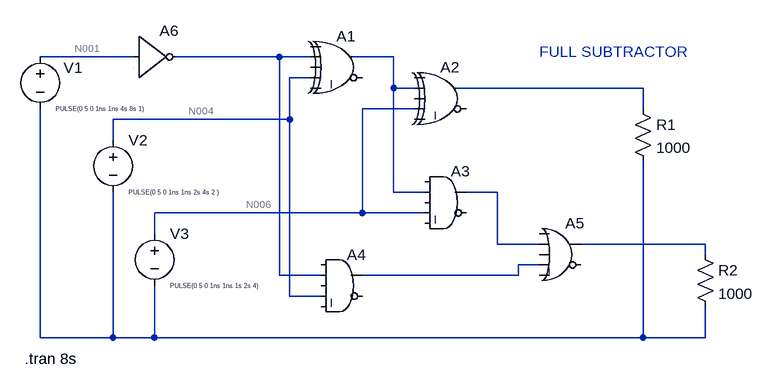
[diagram p0: schematic FULL_SUBTRACTOR_GOKUL.asc]
FULL_SUBTRACTOR_GOKUL.asc, the LTspice schematic file:
Version 4
SHEET 1 880 680
WIRE -272 -48 -416 -48
WIRE -48 -48 -208 -48
WIRE 0 -48 -48 -48
WIRE 128 -48 64 -48
WIRE 0 -16 -32 -16
WIRE 128 0 128 -48
WIRE 160 0 128 0
WIRE 512 0 224 0
WIRE 160 32 80 32
WIRE 512 32 512 0
WIRE -32 48 -32 -16
WIRE -32 48 -304 48
WIRE -304 80 -304 48
WIRE 128 160 128 0
WIRE 176 160 128 160
WIRE 288 160 240 160
WIRE 80 192 80 32
WIRE 80 192 -240 192
WIRE 176 192 80 192
WIRE -240 224 -240 192
WIRE 288 240 288 160
WIRE 352 240 288 240
WIRE 608 240 416 240
WIRE 608 256 608 240
WIRE 352 272 320 272
WIRE -48 288 -48 -48
WIRE 16 288 -48 288
WIRE 320 288 320 272
WIRE 320 288 80 288
WIRE -32 320 -32 48
WIRE 16 320 -32 320
WIRE -416 384 -416 32
WIRE -304 384 -304 160
WIRE -304 384 -416 384
WIRE -240 384 -240 304
WIRE -240 384 -304 384
WIRE 512 384 512 112
WIRE 512 384 -240 384
WIRE 608 384 608 336
WIRE 608 384 512 384
SYMBOL Digital\\xor 48 -96 R0
SYMATTR InstName A1
SYMBOL Digital\\xor 208 -48 R0
SYMATTR InstName A2
SYMBOL Digital\\and 208 112 R0
SYMATTR InstName A3
SYMBOL Digital\\and 48 240 R0
SYMATTR InstName A4
SYMBOL Digital\\or 384 192 R0
SYMATTR InstName A5
SYMBOL voltage -416 -64 R0
WINDOW 3 24 96 Left 0
WINDOW 123 0 0 Left 0
WINDOW 39 0 0 Left 0
WINDOW 0 36 33 Left 2
SYMATTR Value PULSE(0 5 0 1ns 1ns 4s 8s 1)
SYMATTR InstName V1
SYMBOL voltage -304 64 R0
WINDOW 3 24 96 Left 0
WINDOW 123 0 0 Left 0
WINDOW 39 0 0 Left 0
SYMATTR Value PULSE(0 5 0 1ns 1ns 2s 4s 2 )
SYMATTR InstName V2
SYMBOL voltage -240 208 R0
WINDOW 3 24 96 Left 0
WINDOW 123 0 0 Left 0
WINDOW 39 0 0 Left 0
SYMATTR Value PULSE(0 5 0 1ns 1ns 1s 2s 4)
SYMATTR InstName V3
SYMBOL res 496 16 R0
SYMATTR InstName R1
SYMATTR Value 1000
SYMBOL res 592 240 R0
SYMATTR InstName R2
SYMATTR Value 1000
SYMBOL Digital\\inv -272 -112 R0
SYMATTR InstName A6
TEXT -440 416 Left 2 !.tran 8s
TEXT 352 -56 Left 2 ;FULL SUBTRACTOR

The netlist it stands for:
* FULL_SUBTRACTOR_GOKUL.asc
A1 0 N002 0 N004 0 0 N003 0 XOR
A2 0 N003 0 N006 0 0 N005 0 XOR
A3 0 N003 0 N006 0 0 N007 0 AND
A4 0 N002 0 N004 0 0 N009 0 AND
A5 0 N007 0 N009 0 0 N008 0 OR
V1 N001 N010 PULSE(0 5 0 1ns 1ns 4s 8s 1)
V2 N004 N010 PULSE(0 5 0 1ns 1ns 2s 4s 2 )
V3 N006 N010 PULSE(0 5 0 1ns 1ns 1s 2s 4)
R1 N005 N010 1000
R2 N008 N010 1000
A6 N001 0 0 0 0 N002 0 0 BUF
.tran 8s
* FULL SUBTRACTOR
.backanno
.end

* Results of the author's LTspice run, read from the files saved beside the schematic
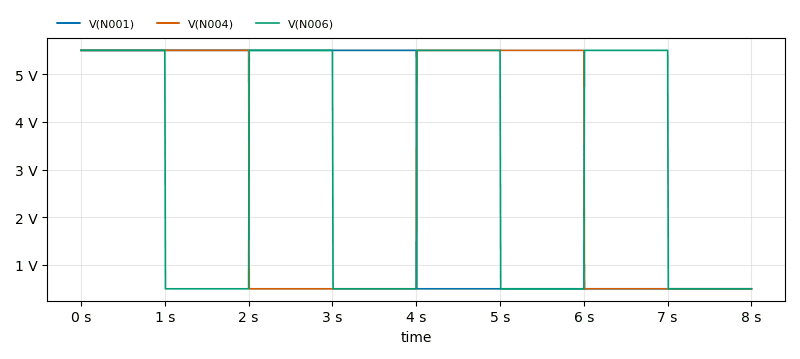
[diagram p1: Transient Analysis of FULL_SUBTRACTOR_GOKUL.asc, plotted from the saved traces]
* Transient Analysis, 1 run:
*   V(N001): min 500 mV, max 5.5 V, average 3.002 V, rms 3.907 V, last 500 mV
*   V(N004): min 500 mV, max 5.5 V, average 3.002 V, rms 3.907 V, last 500 mV
*   V(N006): min 500 mV, max 5.5 V, average 3.002 V, rms 3.907 V, last 500 mV